# Altium project Retro_Stat_ESE516.PrjPcb
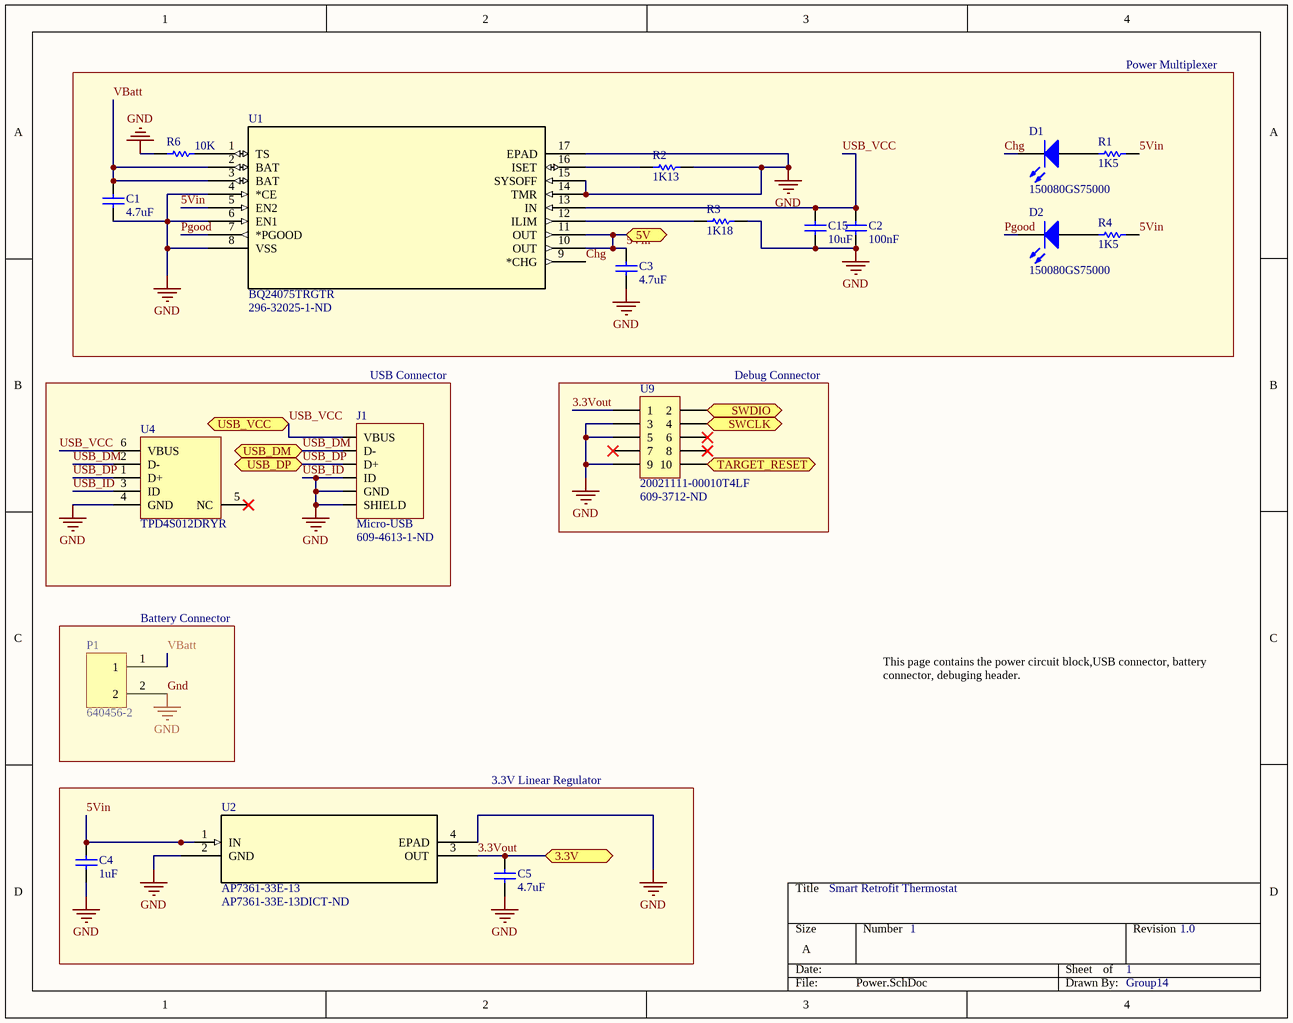
[diagram p0: Power.SchDoc]
3 sheets, 70 parts. Net scope: flat (ports and power ports of the same name join across sheets).
Board file: Retro_Stat_PCB_Layout.PcbDoc
Sheets:
  Power.SchDoc
  WIFI_module.SchDoc
  Sensors_Actuator_lib.SchDoc

## Sheet Power.SchDoc
size A

### Parts
C1  4.7uF  [CAPC0805(2012)155_L]
C2  100nF  [CAPC0805(2012)100_L]
C3  4.7uF  [CAPC0805(2012)155_L]
C4  1uF  [CAPC0805(2012)100_L]
C5  4.7uF  [CAPC0805(2012)155_L]
C15  10uF  [CAPC0805(2012)100_L]
D1  150080GS75000  [0805_A]
D2  150080GS75000  [0805_A]
J1  Micro-USB  Supplier Part Number 1: 609-4613-1-ND  [10118192-0001LF]
P1  640456-2  [640456-2]
R1  1K5  [RESC0805(2012)_M]
R2  1K13  [RESC0805(2012)_L]
R3  1K18  [RESC0805(2012)_M]
R4  1K5  [RESC0805(2012)_M]
R6  10K  [RESC0805(2012)_M]
U1  BQ24075TRGTR  Supplier Part Number 1: 296-32025-1-ND  [RGT16_1P7X1P7]
U2  AP7361-33E-13  Supplier Part Number 1: AP7361-33E-13DICT-ND  [SOT-223]
U4  TPD4S012DRYR  [DRY0006A]
U9  20021111-00010T4LF  Supplier Part Number 1: 609-3712-ND  [20021111-00010T4LF]

### Blocks framed on the sheet
Power Multiplexer: C1-C3 C15 D1 D2 R1-R4 R6 U1
USB Connector: J1 U4
Debug Connector: U9
Battery Connector: P1
3.3V Linear Regulator: C4 C5 U2

### Ports
3.3V, 5V, SWCLK (bidir), SWDIO (bidir), TARGET_RESET (out), USB_DM (bidir), USB_DP (bidir), USB_VCC

### Nets
Gnd: C1.1 C2.1 C3.1 C4.1 C5.1 C15.1 J1.4(ID) J1.5(GND) J1.6(SHIELD) P1.2 R2.2 R3.2 R6.1 U1.4(*CE) U1.6(EN1) U1.8(VSS) U1.14(TMR) U1.15(SYSOFF) U1.17(EPAD) U2.2(GND) U2.4(EPAD) U4.3(ID) U4.4(GND) U9.3 U9.5 U9.9  [also labelled USB_ID]
3.3Vout: C5.2 U2.3(OUT) U9.1 ; port 3.3V
5Vin: C3.2 C4.2 R1.2 R4.2 U1.5(EN2) U1.10(OUT) U1.11(OUT) U2.1(IN) ; port 5V
Chg: D1.1(K) U1.9(*CHG)
Pgood: D2.1(K) U1.7(*PGOOD)
TARGET_RESET: U9.10 ; port TARGET_RESET
USB_DM: J1.2(D-) U4.2(D-) ; port USB_DM
USB_DP: J1.3(D+) U4.1(D+) ; port USB_DP
USB_VCC: C2.2 C15.2 J1.1(VBUS) U1.13(IN) U4.6(VBUS) ; port USB_VCC
VBatt: C1.2 P1.1 U1.2(BAT) U1.3(BAT)
NetD1_2: D1.2(A) R1.1
NetD2_2: D2.2(A) R4.1
NetR2_1: R2.1 U1.16(ISET)
NetR3_1: R3.1 U1.12(ILIM)
NetR6_2: R6.2 U1.1(TS)
NetU3_25: U9.4 ; port SWCLK
NetU3_26: U9.2 ; port SWDIO

Not connected (* = marked no-connect by the designer): U4 5(NC)*; U9 6* 7* 8*

### Notes on the sheet
- This page contains the power circuit block,USB connector, battery connector, debuging header.
- Smart Retrofit Thermostat
- 1
- 1.0
- Group14

### Library data of the parts
C1 C3 C5 = CMP-1036-04882-1: CAP 4.7uF 10V ±10% 0805 (2012 Metric) Thickness 1.55mm SMD; Case-EIA: 0805; Tolerance: Â±10%; Case-Metric: 2012; Value: 4.7uF; Rated Voltage: 10 V; Max Thickness: 1.55 mm; Technology: SMT
C2 = CMP-1036-04407-1: CAP 100nF 16V -20% to +80% 0805 (2012 Metric) Thickness 1mm SMD; Case-EIA: 0805; Case-Metric: 2012; Value: 100nF; Rated Voltage: 16 V; Max Thickness: 1 mm; Technology: SMT; Tolerance: -20% to +80%
C4 = CMP-1036-04734-1: CAP 1uF 6.3V ±20% 0805 (2012 Metric) Thickness 1mm SMD; Case-EIA: 0805; Tolerance: Â±20%; Case-Metric: 2012; Value: 1uF; Rated Voltage: 6.3 V; Max Thickness: 1 mm; Technology: SMT
C15 = CMP-1036-04930-1: CAP 10uF 16V ±20% 0805 (2012 Metric) Thickness 1mm SMD; Case-EIA: 0805; Tolerance: Â±20%; Case-Metric: 2012; Value: 10uF; Rated Voltage: 16 V; Max Thickness: 1 mm; Technology: SMT
D1 D2 = CMP-1426-00007-1: SMD mono-color Chip LED, WL-SMCW, Green; Manufacturer: Wuerth Elektronik; PackageReference: 0805_A; Color: Green; PartNumber: 150080GS75000; ComponentLink2URL: http://katalog.we-online.com/led/datasheet/150080GS75000.pdf; ComponentLink1URL: http://www.we-online.com; ComponentLink1Description: Manufacturer URL; ComponentLink2Description: Datasheet
J1 = 10118192-0001LF: CONN USB MICRO B RECPT SMT R/A; HelpURL: http://portal.fciconnect.com/Comergent//fci/drawing/10118192.pdf; Supplier 1: Digi-Key
P1 = 640456-2: CONN HEADER VERT 2POS .100 TIN; Manufacturer: TE Connectivity; Underplate Material: Nickel; Connector Type: Plug,Pin,Header; Contact Resistance: 6mR; Max Current Rating: 5A; Max Voltage Rating (AC): 250V; Number of Positions: 2; Backwall/Post Interruptions: No (Without); Connector System: Wire-to-Board; Plating Thickness: 3.81um; PCB Mount Retention: Without; Gender: Male; Contact Style: Straight; PCB Mounting Orientation: Vertical; Pitch: 2.54mm; Mating Post Length: 7.49mm; PCB Thickness: 0.063inch; Tail Length: 3.56mm; Approvals: CSA; Supplier 1: Digi-Key; Manufacturer Part Number: 640456-2; Stock 1: 141304; Pricing 1: 1=0.12, 10=0.117, 100=0.0724, 500=0.0599, 1000=0.0524, 5000=0.0449, 10000=0.0437 (USD); Mount: Through Hole; Colour: White,Natural,Beige; Contact Plating: Tin; Contact Material: Copper Alloy; Housing Colour: Natural; Housing Material: Polyester; Contact Shape: Square; Min Operating Temperature: -67°C; Max Operating Temperature: 221°C; Package Quantity: 5000; Packaging: Bulk; Termination: Solder; Number of Rows: 1; Fastening Type: Friction; Contact Gender: Male; Voltage Rating (AC): 250V; Number of Contacts: 2; Orientation: Straight; Contact Retention: No (Without); Mating Alignment: No (Without); Mating Retention: No (Without); PCB Mount Alignment: No (Without); Panel Mount Retention: No (Without); Sealable: No (Without); Strain Relief: No (Without); Current Rating: 5A; Number of Poles: 2; Voltage Rating: 250V; Working Voltage: 250V; Length: 5.08mm; Height: 7.87mm; Depth: 5.72mm; Lead Pitch: 2.54mm; Contact Mating Length: 0.295inch; Termination Post Length: 3.56mm; Radiation Hardening: No; ELV: Compliant; Lead Free: Lead Free; Flammability Rating: UL94 V-0; REACH SVHC: No SVHC; ComponentLink1URL: https://datasheet.ciiva.com/709/eng-cd-640456-w1-709680.pdf; ComponentLink1Description: https://datasheet.ciiva.com/709/eng-cd-640456-w1-709680.pdf; ComponentLink2URL: https://datasheet.ciiva.com/3118/eng-ds-82056-mta-0608-3118497.pdf; ComponentLink2Description: https://datasheet.ciiva.com/3118/eng-ds-82056-mta-0608-3118497.pdf; ComponentLink3URL: https://datasheet.ciiva.com/19462/613931-19462481.pdf; ComponentLink3Description: https://datasheet.ciiva.com/19462/613931-19462481.pdf; ComponentLink4URL: https://datasheet.ciiva.com/14156/04384301-14156820.pdf; ComponentLink4Description: https://datasheet.ciiva.com/14156/04384301-14156820.pdf; ComponentLink5URL: https://datasheet.ciiva.com/7128/1866390-7128742.pdf; ComponentLink5Description: https://datasheet.ciiva.com/7128/1866390-7128742.pdf; ComponentLink6URL: https://datasheet.ciiva.com/16401/eng-ds-82056-mta-0608-16401289.pdf; ComponentLink6Description: https://datasheet.ciiva.com/16401/eng-ds-82056-mta-0608-16401289.pdf; ComponentLink7URL: https://datasheet.ciiva.com/16505/eng-ds-82056-mta-0608-16505419.pdf; ComponentLink7Description: https://datasheet.ciiva.com/16505/eng-ds-82056-mta-0608-16505419.pdf; ComponentLink8URL: https://datasheet.ciiva.com/25617/0900766b80027008-25617244.pdf; ComponentLink8Description: https://datasheet.ciiva.com/25617/0900766b80027008-25617244.pdf; ComponentLink9URL: https://datasheet.ciiva.com/11746/0900766b80eb7fdd-11746365.pdf; ComponentLink9Description: https://datasheet.ciiva.com/11746/0900766b80eb7fdd-11746365.pdf; Supplier Part Number 1: A1921-ND
R1 R4 = CMP-1013-00528-1: 1K5 0.125W 1% 0805 (2012 Metric)  SMD; Value: 1500.00 Ohm; Case-Metric: 2012; Case-EIA: 0805; Technology: SMT; Power: 0.125 W; Tolerance: 1 %
R2 = CMP-1013-00515-1: 1K13 0.125W 1% 0805 (2012 Metric)  SMD; Value: 1130.00 Ohm; Case-Metric: 2012; Case-EIA: 0805; Tolerance: 1 %; Technology: SMT; Power: 0.125 W
R3 = CMP-1013-00517-1: 1K18 0.125W 1% 0805 (2012 Metric)  SMD; Value: 1180.00 Ohm; Case-EIA: 0805; Case-Metric: 2012; Tolerance: 1 %; Technology: SMT; Power: 0.125 W
R6 = CMP-1013-00623-1: 10K 0.125W 1% 0805 (2012 Metric)  SMD; Value: 10000.00 Ohm; Case-Metric: 2012; Case-EIA: 0805; Technology: SMT; Power: 0.125 W; Tolerance: 1 %
U1 = BQ24075TRGTR: Imported; Manufacturer: Texas Instruments; Built_By: EMA_UL_Team; C: Copyright (C) 2015 Accelerated Designs. All rights reserved; Vendor: Vendor; Manufacturer_Part_Number: BQ24075TRGTR; Value: Value; Type: Type; RefDes: RefDes; Supplier 1: Digi-Key
U2 = AP7361-33E-13: Imported; Vendor: Diodes Inc; Built_By: EMA_UL_Team; Manufacturer_Part_Number: AP7361-33E-13; Value: Value; Type: Type; RefDes: RefDes; Supplier 1: Digi-Key
U4 = CMP-0326-00038-3: USB ESD Solution with Power Clamp, 4 Channels, -40 to +85 degC, 6-pin SON (DRY), Green (RoHS & no Sb/Br); Manufacturer: Texas Instruments; IO Capacitance(Typ)(pF): 0.8; USB High Speed: TRUE; IEC 61000-4-2 Air-Gap(+/- kV): 10; Breakdown Voltage(Min)(V): 6; PackageDescription: 6-Pin Plastic Small Outline No-Lead, 1 x 1.45 x 0.6 mm Body, 0.5 mm Pitch; ComponentLink2URL: http://www.ti.com/general/docs/lit/getliterature.tsp?genericPartNumber=TPD4S012&fileType=pdf; PackageVersion: revF, Dec-2011; ComponentLink3URL: SamplesURL:http://www.ti.com/product/tpd4s012#samples; ComponentLink2Description: Datasheet; IEC 61000-4-2 Contact(+/- kV): 10; DatasheetVersion: SLVS928A; PackageReference: DRY0006A; ComponentLink3Description: URL Link1; Mounting Technology: Surface Mount; PartNumber: TPD4S012DRYR; ComponentLink1Description: Manufacturer URL; SubFamily: ESD Solution; IO Leakage Current(nA): 10; ComponentLink1URL: http://www.ti.com/; Eco-Plan: Green (RoHS & no Sb/Br)
U9 = 20021111-00010T4LF: CONN HEADER 10POS UNSHD VERT T/H; Manufacturer: Amphenol / FCI; Stack Height: 2.5 mm; Number of Positions / Contacts: 10; Brand: FCI; Pitch: 1.27 mm; Mounting Angle: Vertical; Current Rating: 10 A; Mating Post Length: 3.05 mm; Voltage Rating: 125 V; Manufacturer Part Number: 20021111-00010T4LF; Mounting Style: Through Hole; Product Category: Headers & Wire Housings; RoHS: Details; Series: Minitek; Product Type: Headers; Type: Unshrouded; Number of Positions: 10; Number of Rows: 2; Contact Plating: Gold; Housing Material: Plastic; Termination Style: Through Hole; Contact Material: Nickel; Packaging: Tube; Factory Pack Quantity: 93; Termination Post Length: 2.3 mm; ComponentLink1URL: https://datasheet.ciiva.com/1433/1079612-1433267.pdf; ComponentLink1Description: https://datasheet.ciiva.com/1433/1079612-1433267.pdf; ComponentLink2URL: https://datasheet.ciiva.com/409/20021111-409158.pdf; ComponentLink2Description: https://datasheet.ciiva.com/409/20021111-409158.pdf; ComponentLink3URL: https://datasheet.ciiva.com/5131/20021111-5131386.pdf; ComponentLink3Description: https://datasheet.ciiva.com/5131/20021111-5131386.pdf; ComponentLink4URL: https://datasheet.ciiva.com/9465/20021111-9465402.pdf; ComponentLink4Description: https://datasheet.ciiva.com/9465/20021111-9465402.pdf; Supplier 1: Digi-Key

## Sheet WIFI_module.SchDoc
size A
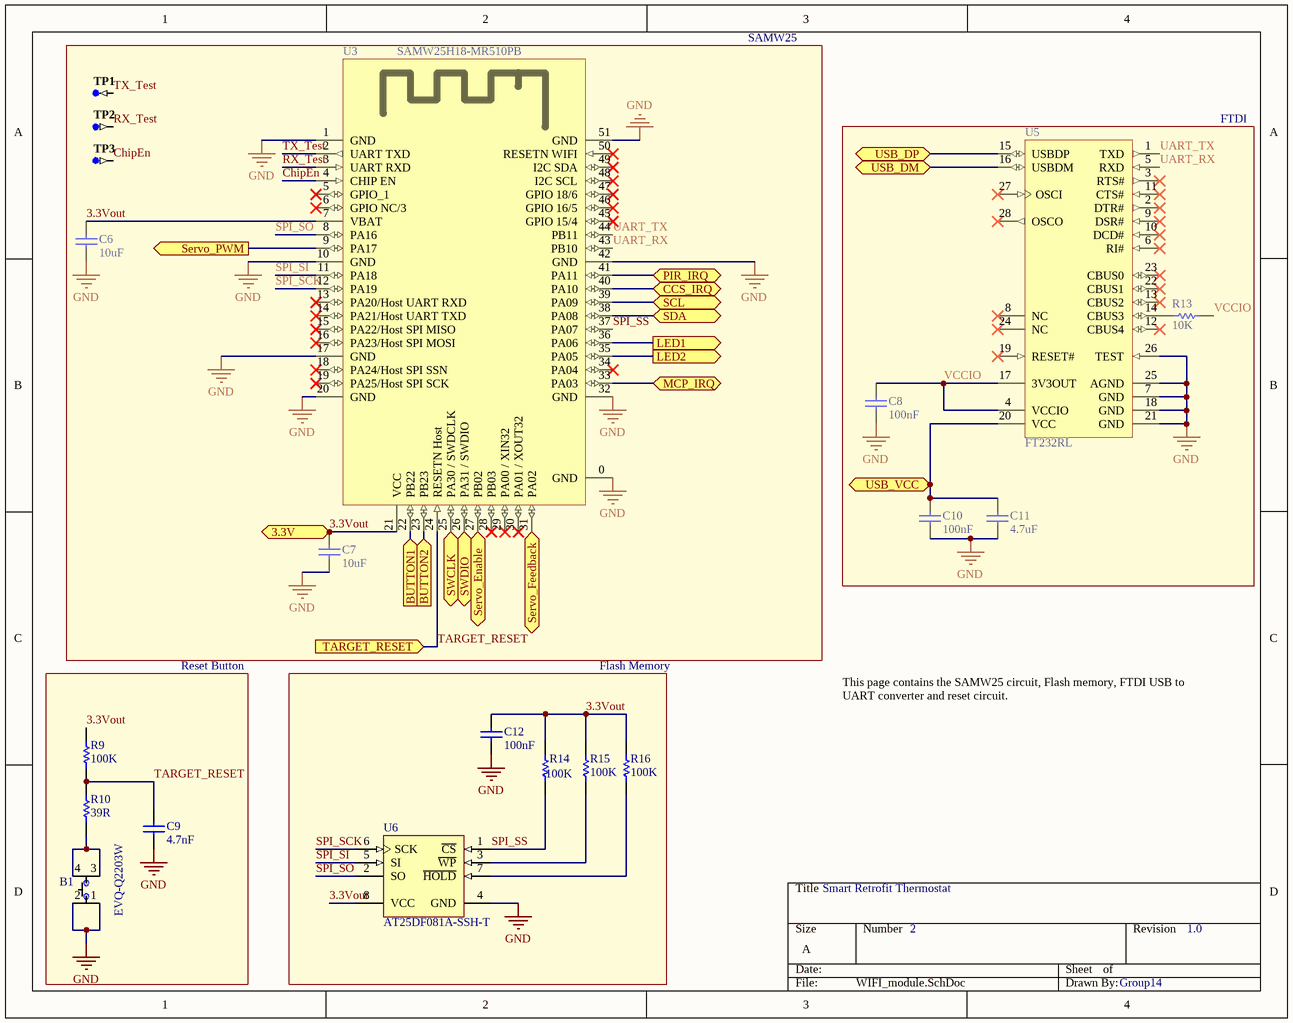
[diagram p1: WIFI_module.SchDoc]

### Parts
B1  EVQ-Q2203W  [EVQ-Q2203W]
C6  10uF  [CAPC0805(2012)100_L]
C7  10uF  [CAPC0805(2012)100_L]
C8  100nF  [CAPC0805(2012)145_M]
C9  4.7nF  [CAPC0805(2012)100_L]
C10  100nF  [CAPC0805(2012)145_M]
C11  4.7uF  [CAPC0805(2012)155_L]
C12  100nF  [CAPC0805(2012)145_M]
R9  100K  [RESC0805(2012)_L]
R10  39R  [RESC0805(2012)_N]
R13  10K  [RESC0805(2012)_M]
R14  100K  [RESC0805(2012)_L]
R15  100K  [RESC0805(2012)_L]
R16  100K  [RESC0805(2012)_L]
TP1  (no value)  [TP-SM-C-100]  (no BOM)
TP2  (no value)  [TP-SM-C-100]  (no BOM)
TP3  (no value)  [TP-SM-C-100]  (no BOM)
U3  SAMW25H18-MR510PB  [SAMW25H18-MR510PB]
U5  FT232RL  [FTDI-SSOP-28_M]
U6  AT25DF081A-SSH-T  [AT25DF081A-SSH-T]

### Blocks framed on the sheet
SAMW25: C6 C7 TP1-TP3 U3
FTDI: C8 C10 C11 R13 U5
Reset Button: B1 C9 R9 R10
Flash Memory: C12 R14-R16 U6

### Ports
3.3V, BUTTON1 (in), BUTTON2 (in), CCS_IRQ, LED1 (out), LED2 (out), MCP_IRQ, PIR_IRQ, SCL (bidir), SDA (bidir), Servo_Enable (out), Servo_Feedback (in), Servo_PWM (out), SWCLK (bidir), SWDIO (bidir), TARGET_RESET (in), USB_DM, USB_DP, USB_VCC

### Nets
Gnd: B1.1 B1.2 C6.1 C7.1 C8.1 C9.1 C10.1 C11.1 C12.1 U3.0(GND) U3.1(GND) U3.10(GND) U3.17(GND) U3.20(GND) U3.32(GND) U3.42(GND) U3.51(GND) U5.7(GND) U5.18(GND) U5.21(GND) U5.25(AGND) U5.26(TEST) U6.4(GND)
3.3Vout: C6.2 C7.2 C12.2 R9.1 R14.1 R15.1 R16.1 U3.7(VBAT) U3.21(VCC) U6.8(VCC) ; port 3.3V
CCS_IRQ: U3.40(PA10) ; port CCS_IRQ
ChipEn: TP3.1 U3.4(CHIP_EN)
MCP_IRQ: U3.33(PA03) ; port MCP_IRQ
RX_Test: TP2.1 U3.3(UART_RXD)
SCL: U3.39(PA09) ; port SCL
SDA: U3.38(PA08) ; port SDA
SPI_SCK: U3.12(PA19) U6.6(SCK)
SPI_SI: U3.11(PA18) U6.5(SI)
SPI_SO: U3.8(PA16) U6.2(SO)
SPI_SS: R14.2 U3.37(PA07) U6.1(~{CS})
TARGET_RESET: C9.2 R9.2 R10.1 U3.24(RESETN_Host) ; port TARGET_RESET
TX_Test: TP1.1 U3.2(UART_TXD)
UART_RX: U3.43(PB10) U5.5(RXD)
UART_TX: U3.44(PB11) U5.1(TXD)
USB_DM: U5.16(USBDM) ; port USB_DM
USB_DP: U5.15(USBDP) ; port USB_DP
USB_VCC: C10.2 C11.2 U5.20(VCC) ; port USB_VCC
VCCIO: C8.2 R13.2 U5.4(VCCIO) U5.17(3V3OUT)
NetB1_3: B1.3 B1.4 R10.2
NetC13_2: U3.22(PB22) ; port BUTTON1
NetC14_2: U3.23(PB23) ; port BUTTON2
NetP2_2: U3.41(PA11) ; port PIR_IRQ
NetP3_1: U3.9(PA17) ; port Servo_PWM
NetR7_2: U3.36(PA06) ; port LED1
NetR11_2: U3.35(PA05) ; port LED2
NetR12_1: U3.31(PA02) ; port Servo_Feedback
NetR13_1: R13.1 U5.14(CBUS3)
NetR15_2: R15.2 U6.3(~{WP})
NetR16_2: R16.2 U6.7(~{HOLD})
NetR20_2: U3.27(PB02) ; port Servo_Enable
NetU3_25: U3.25(PA30_/_SWDCLK) ; port SWCLK
NetU3_26: U3.26(PA31_/_SWDIO) ; port SWDIO

Not connected (* = marked no-connect by the designer): U3 5(GPIO_1)* 6(GPIO_NC/3)* 13(PA20/Host_UART_RXD)* 14(PA21/Host_UART_TXD)* 15(PA22/Host_SPI_MISO)* 16(PA23/Host_SPI_MOSI)* 18(PA24/Host_SPI_SSN)* 19(PA25/Host_SPI_SCK)* 28(PB03)* 29(PA00_/_XIN32)* 30(PA01_/_XOUT32)* 34(PA04)* 45(GPIO_15/4)* 46(GPIO_16/5)* 47(GPIO_18/6)* 48(I2C_SCL)* 49(I2C_SDA)* 50(RESETN_WIFI)*; U5 2(DTR#)* 3(RTS#)* 6(RI#)* 8(NC)* 9(DSR#)* 10(DCD#)* 11(CTS#)* 12(CBUS4)* 13(CBUS2)* 19(RESET#)* 22(CBUS1)* 23(CBUS0)* 24(NC)* 27(OSCI)* 28(OSCO)*

### Notes on the sheet
- This page contains the SAMW25 circuit, Flash memory, FTDI USB to UART converter and reset circuit.
- Smart Retrofit Thermostat
- 2
- 1.0
- Group14

### Library data of the parts
B1 = EVQ-Q2203W: SWITCH TACTILE SPST-NO 0.02A 15V; Manufacturer: Panasonic Electronic Components; Switch Function: Off-Mom; Contact Rating @ Voltage: 0.02A @ 15VDC; Actuator Type: Standard; Actuator Height off PCB, Vertical: 3.10mm; Actuator Orientation: Top Actuated; Outline: 6.60mm x 6.00mm; Illumination: Non-Illuminated; Operating Force: 350gf; Switch Travel: 0.25mm; Mechanical Life: 100,000 Cycles; Supplier 1: Digi-Key; Manufacturer Part Number: EVQ-Q2203W; RoHS: RoHS Compliant; Category: Switches; Stock 1: 15024; Pricing 1: 1=0.3, 10=0.287, 25=0.2772, 50=0.2674, 100=0.2525, 250=0.2376, 500=0.2277, 1000=0.17325 (USD); Packaging: Cut Tape (CT); Part Status: Active; Circuit: SPST-NO; Mounting Type: Surface Mount; Actuator Length, Right Angle: -; Termination Style: J Lead; Illumination Type, Color: -; Illumination Voltage (Nominal): -; Ingress Protection: -; Features: Grounding Pin; Actuator Material: -; Operating Temperature: -40°C ~ 85°C; ComponentLink1URL: https://industrial.panasonic.com/cdbs/www-data/pdf/ATK0000/ATK0000CE28.pdf; ComponentLink1Description: https://industrial.panasonic.com/cdbs/www-data/pdf/ATK0000/ATK0000CE28.pdf; Supplier Part Number 1: P12964SCT-ND
C6 C7 = CMP-1036-04930-1: as C15 on sheet Power; Value: 10uF; Rated Voltage: 16 V; Max Thickness: 1 mm; Technology: SMT
C8 C10 C12 = CMP-1036-04404-1: CAP 100nF 16V ±20% 0805 (2012 Metric) Thickness 1.45mm SMD; Case-EIA: 0805; Tolerance: Â±20%; Case-Metric: 2012; Value: 100nF; Rated Voltage: 16 V; Max Thickness: 1.45 mm; Technology: SMT
C9 = CMP-1036-03568-1: CAP 4.7nF 16V ±20% 0805 (2012 Metric) Thickness 1mm SMD; Case-EIA: 0805; Tolerance: Â±20%; Case-Metric: 2012; Value: 4.7nF; Rated Voltage: 16 V; Max Thickness: 1 mm; Technology: SMT
C11 = CMP-1036-04882-1: as C1 on sheet Power; Value: 4.7uF; Rated Voltage: 10 V; Max Thickness: 1.55 mm; Technology: SMT
R9 R14-R16 = CMP-1013-00736-1: 100K 0.125W 1% 0805 (2012 Metric)  SMD; Value: 100000.00 Ohm; Case-Metric: 2012; Case-EIA: 0805; Technology: SMT; Power: 0.125 W; Tolerance: 1 %
R10 = CMP-1013-00350-1: 39R 0.125W 1% 0805 (2012 Metric)  SMD; Value: 39.00 Ohm; Case-Metric: 2012; Case-EIA: 0805; Technology: SMT; Power: 0.125 W; Tolerance: 1 %
R13 = CMP-1013-00623-1: as R6 on sheet Power; Technology: SMT; Power: 0.125 W; Tolerance: 1 %
TP1-TP3 = CMP-0484-00002-2: Test Point, Surface Mount, Circular, Pad Diameter 1 mm; Manufacturer: No Vendor; PartNumber: TP-SM-C-100
U3 = SAMW25H18-MR510PB: RF TXRX MODULE WIFI TRACE ANT; Manufacturer: Atmel; Manufacturer Part Number: ATSAMW25H18-MR510PB; Protocol: 802.11b/g/n; Frequency: 2.4GHz; Data Rate: 65Mbps; Power - Output: 17dBm; Sensitivity: -95.5dBm; Serial Interfaces: SPI, UART; Antenna Type: Integrated, Trace; Memory Size: 256kB Flash, 32kB SRAM; Voltage - Supply: 2.7 V ~ 4.2 V; Category: RF/IF and RFID; Family: RF Transceiver Modules; Series: Xplained Pro; Packaging: Tray; RF Family/Standard: WiFi; Modulation: -; Current - Receiving: -; Current - Transmitting: -; Mounting Type: Surface Mount; Operating Temperature: -40°C ~ 85°C; Package / Case: Module; ComponentLink1URL: http://www.atmel.com/devices/ATSAMW25.aspx; ComponentLink1Description: http://www.atmel.com/devices/ATSAMW25.aspx; ComponentLink2URL: http://www.farnell.com/datasheets/1965115.pdf; ComponentLink2Description: http://www.farnell.com/datasheets/1965115.pdf; Supplier 1: Digikey; Stock 1: 120; Pricing 1: 1=19.14 (USD); Supplier Part Number 1: ATSAMW25H18-MR510PB-ND
U5 = CMP-2000-05029-1: IC USB FS SERIAL UART 28-SSOP; Manufacturer: FTDI; Receive FIFO: 256B; Number of Channels per Chip: 1; Maximum Data Rate: 3MBd; Transmit FIFO: 128B; Dimensions: 10.2x5.3x1.75mm; Mounting Type: SurfaceMount; Height: 1.75mm; Package Type: SSOP; Datasheet Version: Rev. 1.04, 02/2006; Width: 5.3mm; Manufacturer URL: http://www.ftdichip.com/; Datasheet URL: http://datasheet.octopart.com/FT232RL-FTDI-datasheet-120501.pdf; Maximum Operating Temperature: +85degC; Minimum Operating Temperature: -40degC; Pin Count: 28; Length: 10.2mm
U6 = AT25DF081A-SSH-T: IC FLASH 8MBIT 100MHZ 8SOIC; Manufacturer: Adesto Technologies; Memory Size: 8M (4096 pages x 256 bytes); Interface: SPI, RapidS; Voltage - Supply: 2.7 V ~ 3.6 V; Rad Hard: No; Manufacturer Part Number: AT25DF081A-SSH-T; RoHS: RoHS Compliant; Category: Integrated Circuits (ICs); Packaging: Cut Tape (CT); Part Status: Active; Format - Memory: FLASH; Memory Type: FLASH; Speed: 100MHz; Operating Temperature: -40°C ~ 85°C (TC); Package / Case: 8-SOIC (0.154", 3.90mm Width); Supplier Device Package: 8-SOIC; ComponentLink1URL: http://www.adestotech.com/wp-content/uploads/doc8715.pdf; ComponentLink1Description: http://www.adestotech.com/wp-content/uploads/doc8715.pdf; Supplier 1: Digikey; Stock 1: 2550; Pricing 1: 1=1.18, 10=1.081, 25=1.0516, 50=1.0462, 100=0.9352, 250=0.9324, 500=0.9185, 1000=0.8791 (USD); Package: 8SOIC; ComponentLink2URL: https://datasheet.ciiva.com/14084/doc8715-14084443.pdf; ComponentLink2Description: https://datasheet.ciiva.com/14084/doc8715-14084443.pdf; ComponentLink3URL: https://datasheet.ciiva.com/26910/getdatasheetpartid-730210-26910875.pdf; ComponentLink3Description: https://datasheet.ciiva.com/26910/getdatasheetpartid-730210-26910875.pdf; ComponentLink4URL: https://datasheet.ciiva.com/12251/doc8715-12251468.pdf; ComponentLink4Description: https://datasheet.ciiva.com/12251/doc8715-12251468.pdf; Supplier Part Number 1: 1265-1166-1-ND

## Sheet Sensors_Actuator_lib.SchDoc
size A
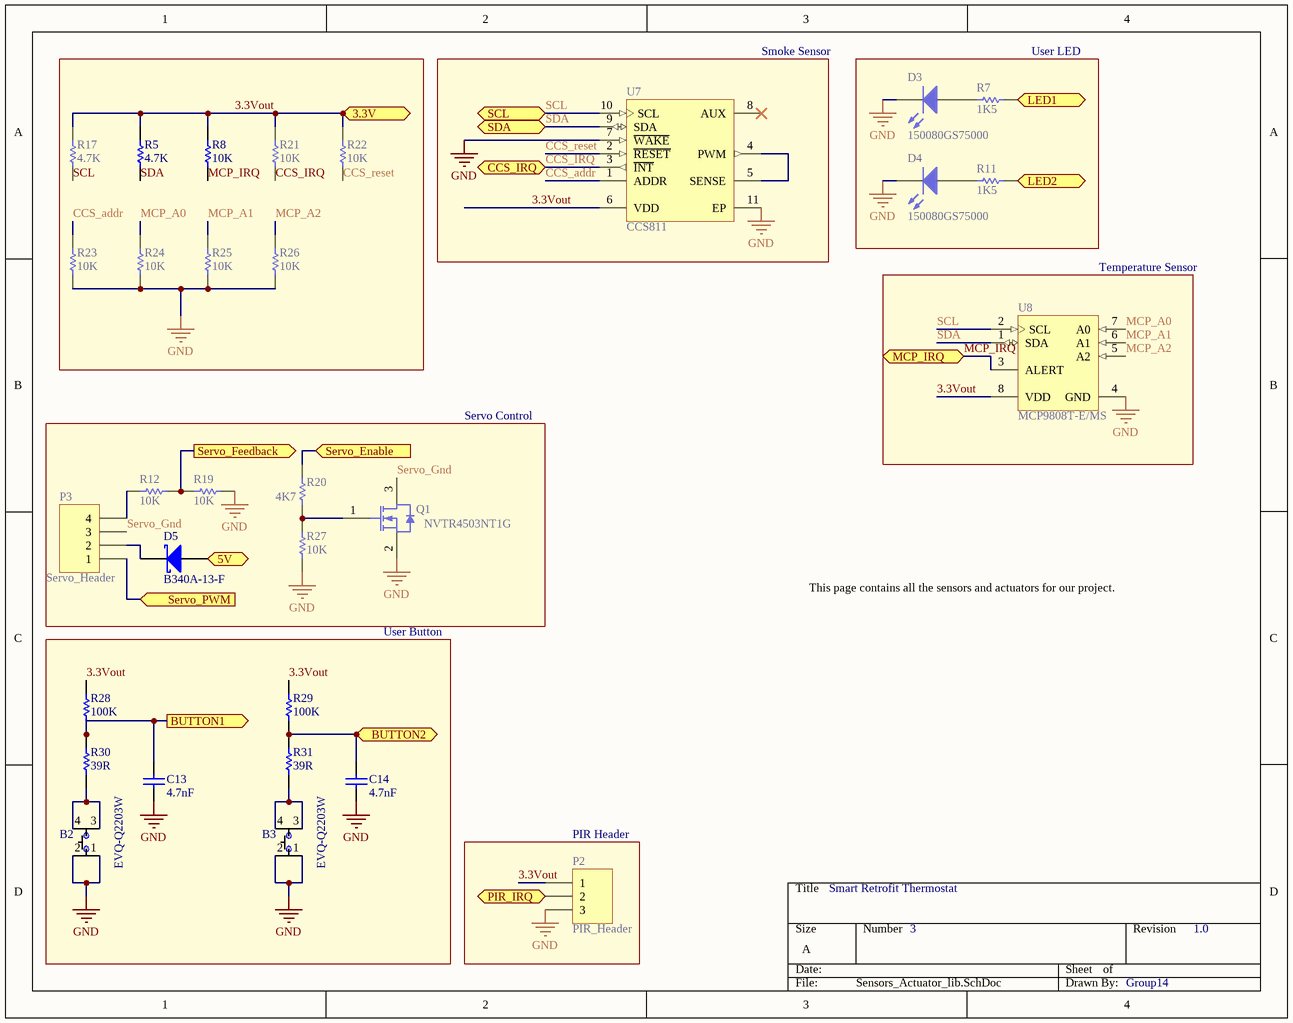
[diagram p2: Sensors_Actuator_lib.SchDoc]

### Parts
B2  EVQ-Q2203W  [EVQ-Q2203W]
B3  EVQ-Q2203W  [EVQ-Q2203W]
C13  4.7nF  [CAPC0805(2012)100_L]
C14  4.7nF  [CAPC0805(2012)100_L]
D3  150080GS75000  [0805_A]
D4  150080GS75000  [0805_A]
D5  B340A-13-F  [DIOD-SMA-2_V]
P2  PIR_Header  [HDR1X3]
P3  Servo_Header  [HDR1X4]
Q1  NVTR4503NT1G  [ONSC-SOT-23-3-318-08_V]
R5  4.7K  [RESC2113X50X35ML15T15]
R7  1K5  [RESC0805(2012)_M]
R8  10K  [RESC0805(2012)_M]
R11  1K5  [RESC0805(2012)_M]
R12  10K  [RESC0805(2012)_M]
R17  4.7K  [RESC2113X50X35ML15T15]
R19  10K  [RESC0805(2012)_M]
R20  4K7  [RESC0805(2012)_M]
R21  10K  [RESC0805(2012)_M]
R22  10K  [RESC0805(2012)_M]
R23  10K  [RESC0805(2012)_M]
R24  10K  [RESC0805(2012)_M]
R25  10K  [RESC0805(2012)_M]
R26  10K  [RESC0805(2012)_M]
R27  10K  [RESC0805(2012)_M]
R28  100K  [RESC0805(2012)_L]
R29  100K  [RESC0805(2012)_L]
R30  39R  [RESC0805(2012)_N]
R31  39R  [RESC0805(2012)_N]
U7  CCS811  [AMS-LGA-10_V]
U8  MCP9808T-E/MS  [MCHP-MSOP-MS8_M]

### Blocks framed on the sheet
Smoke Sensor: U7
User LED: D3 D4 R7 R11
Temperature Sensor: U8
Servo Control: D5 P3 Q1 R12 R19 R20 R27
User Button: B2 B3 C13 C14 R28-R31
PIR Header: P2

### Ports
3.3V, 5V, BUTTON1 (out), BUTTON2 (out), CCS_IRQ, LED1 (in), LED2 (in), MCP_IRQ, PIR_IRQ, SCL (bidir), SDA (bidir), Servo_Enable (in), Servo_Feedback (out), Servo_PWM (in)

### Nets
Gnd: B2.1 B2.2 B3.1 B3.2 C13.1 C14.1 D3.1(K) D4.1(K) P2.3 Q1.2(S) R19.1 R23.1 R24.1 R25.1 R26.1 R27.1 U7.7(~{WAKE}) U7.11(EP) U8.4(GND)
3.3Vout: P2.1 R5.2 R8.2 R17.2 R21.2 R22.2 R28.1 R29.1 U7.6(VDD) U8.8(VDD) ; port 3.3V
5Vin: D5.1(A) ; port 5V
CCS_addr: R23.2 U7.1(ADDR)
CCS_IRQ: R21.1 U7.3(~{INT}) ; port CCS_IRQ
CCS_reset: R22.1 U7.2(~{RESET})
MCP_A0: R24.2 U8.7(A0)
MCP_A1: R25.2 U8.6(A1)
MCP_A2: R26.2 U8.5(A2)
MCP_IRQ: R8.1 U8.3(ALERT) ; port MCP_IRQ
SCL: R17.1 U7.10(SCL) U8.2(SCL) ; port SCL
SDA: R5.1 U7.9(SDA) U8.1(SDA) ; port SDA
Servo_Gnd: P3.3 Q1.3(D)
NetB2_3: B2.3 B2.4 R30.2
NetB3_3: B3.3 B3.4 R31.2
NetC13_2: C13.2 R28.2 R30.1 ; port BUTTON1
NetC14_2: C14.2 R29.2 R31.1 ; port BUTTON2
NetD3_2: D3.2(A) R7.1
NetD4_2: D4.2(A) R11.1
NetD5_2: D5.2(K) P3.2
NetP2_2: P2.2 ; port PIR_IRQ
NetP3_1: P3.1 ; port Servo_PWM
NetP3_4: P3.4 R12.2
NetQ1_1: Q1.1(G) R20.1 R27.2
NetR7_2: R7.2 ; port LED1
NetR11_2: R11.2 ; port LED2
NetR12_1: R12.1 R19.2 ; port Servo_Feedback
NetR20_2: R20.2 ; port Servo_Enable
NetU7_4: U7.4(PWM) U7.5(SENSE)

Not connected (* = marked no-connect by the designer): U7 8(AUX)*

### Notes on the sheet
- This page contains all the sensors and actuators for our project.
- Smart Retrofit Thermostat
- 3
- 1.0
- Group14

### Library data of the parts
B2 B3 = EVQ-Q2203W: as B1 on sheet WIFI_module; Supplier 1: Digi-Key; Manufacturer Part Number: EVQ-Q2203W; RoHS: RoHS Compliant; Category: Switches; Stock 1: 15024; Pricing 1: 1=0.3, 10=0.287, 25=0.2772, 50=0.2674, 100=0.2525, 250=0.2376, 500=0.2277, 1000=0.17325 (USD); Packaging: Cut Tape (CT); Part Status: Active; Circuit: SPST-NO; Mounting Type: Surface Mount; Actuator Length, Right Angle: -; Termination Style: J Lead; Illumination Type, Color: -; Illumination Voltage (Nominal): -; Ingress Protection: -; Features: Grounding Pin; Actuator Material: -; Operating Temperature: -40°C ~ 85°C; ComponentLink1URL: https://industrial.panasonic.com/cdbs/www-data/pdf/ATK0000/ATK0000CE28.pdf; ComponentLink1Description: https://industrial.panasonic.com/cdbs/www-data/pdf/ATK0000/ATK0000CE28.pdf; Supplier Part Number 1: P12964SCT-ND
C13 C14 = CMP-1036-03568-1: as C9 on sheet WIFI_module; Value: 4.7nF; Rated Voltage: 16 V; Max Thickness: 1 mm; Technology: SMT
D3 D4 = CMP-1426-00007-1: as D1 on sheet Power; PackageReference: 0805_A; Color: Green; PartNumber: 150080GS75000; ComponentLink2URL: http://katalog.we-online.com/led/datasheet/150080GS75000.pdf; ComponentLink1URL: http://www.we-online.com; ComponentLink1Description: Manufacturer URL; ComponentLink2Description: Datasheet
D5 = CMP-1667-00003-1: Surface Mount Schottky Barrier Rectifier, 40 V, 3 A, -55 to 150 degC, 2-Pin SMA, RoHS, Tape and Reel; Forward Current: 3 A; Forward Voltage: 500 mV; Max Surge Current: 80 A; Peak Reverse Current: 500 uA; Elements: 1; Mounting Technology: Surface Mount; ComponentLink1URL: http://www.diodes.com/; PackageDescription: 2-Pin Surface Mounted Assembly, Body 4.3 x 2.605 mm, Height 2.4 mm; Min Operating Temperature: -55 degC; Mount: Surface Mount; Pins: 2; ComponentLink2URL: http://www.diodes.com/_files/datasheets/ds30891.pdf; PackageReference: SMA-2; Max Operating Temperature: 125 degC; Radiation Hardening: No; Length: 4.6 mm; RoHSCompliant: true; ComponentLink1Description: Manufacturer URL; Height: 2.1 mm; ComponentLink2Description: Datasheet; Packaging: Tape and Reel; Package Quantity: 5000; Case\Package: SMA; DatasheetVersion: Rev. 17 - 2, 09/2015; REACH SVHC: No SVHC; Width: 2.92 mm
P2 = Header 3: Header, 3-Pin; LatestRevisionDate: 17-Jul-2002; LatestRevisionNote: Re-released for DXP Platform.; Publisher: Altium Limited
P3 = Header 4: Header, 4-Pin; LatestRevisionDate: 17-Jul-2002; LatestRevisionNote: Re-released for DXP Platform.; Publisher: Altium Limited
Q1 = CMP-1058-00743-1: Power MOSFET, 30 V, 2.5 A, Single N-Channel, 3-Pin SOT-23, Pb-Free, Tape and Reel; Manufacturer: On Semiconductor; VGS(th) Max (V): 3; VGS Max (V): 20; Channel Polarity: N Channel; ID Max (A): 2.5; Qrr Typ (nC): 4; V(BR)DSS Min (V): 30; PackageReference: SOT-23-3-318-08; RoHS: Pb-Free; ComponentLink3Description: Package Specification; PackageVersion: Rev. AP, 11/2009; PartNumber: NVTR4503NT1G; ComponentLink1URL: http://www.onsemi.com/; ComponentLink2URL: http://www.onsemi.cn/pub_link/Collateral/NTR4503N-D.PDF; ComponentLink1Description: Manufacturer URL; Packing: Tape and Reel; ComponentLink2Description: Datasheet; Package Type: SOT-23-3; Configuration: Single; Mounting Technology: Surface Mount; ComponentLink3URL: http://www.onsemi.cn/pub_link/Collateral/318-08.PDF; PackageDescription: 3-Pin Small Outline Transistor, Body 2.92 x 1.3 mm, Pitch 0.95 mm; DatasheetVersion: Rev. 6
R5 R17 = CMP-2100-03615-1: Chip Resistor, 4.7 KOhm, +/- 1%, 0.125 W, -55 to 155 degC, 0805 (2012 Metric), RoHS, Tape and Reel; Manufacturer: Vishay Semiconductor; Temperature Coefficient: 100ppm/degreesC; Voltage Rating: 150V; Max Power Dissipation: 125mW; Tolerance: 1%; Packaging: TapeandReel; Max Operating Temperature: 155degC; Case Code (Imperial): 0805; Case/Package: 0805; Radiation Hardening: No; Package Reference: 0805; Lead Free: LeadFree; Package Description: 2-Pin Surface Mount Device, Body 2.05 x 1.25 mm; Manufacturer URL: http://www.vishay.com/; Height: 0.45mm; REACH SVHC: Unknown; Termination: SMD/SMT; Length: 2mm; Depth: 1.25mm; Case Code (Metric): 2012; Package Quantity: 10; Weight: 0.000194oz; Military Standard: Not; RoHSCompliant: true; Composition: ThickFilm; Contact Plating: Tin; Datasheet Version: 41061.0; Datasheet URL: https://datasheet.ciiva.com/11808/0900766b80d98b26-11808992.pdf; Width: 1.25mm; Number of Terminations: 2; Min Operating Temperature: -55degC; Power Rating: 125mW; Resistance: 4.7KOhm; Voltage Rating (DC): 150V
R7 R11 = CMP-1013-00528-1: as R1 on sheet Power; Technology: SMT; Power: 0.125 W; Tolerance: 1 %
R8 R12 R19 R21-R27 = CMP-1013-00623-1: as R6 on sheet Power; Technology: SMT; Power: 0.125 W; Tolerance: 1 %
R20 = CMP-1013-00586-1: 4K7 0.125W 1% 0805 (2012 Metric)  SMD; Case-Metric: 2012; Case-EIA: 0805; Value: 4700.00 Ohm; Technology: SMT; Power: 0.125 W; Tolerance: 1 %
R28 R29 = CMP-1013-00736-1: as R9 on sheet WIFI_module; Technology: SMT; Power: 0.125 W; Tolerance: 1 %
R30 R31 = CMP-1013-00350-1: as R10 on sheet WIFI_module; Technology: SMT; Power: 0.125 W; Tolerance: 1 %
U7 = CMP-2000-07443-1: Ultra-Low Power Digital Gas Sensor for Monitoring Indoor Air Quality, 26 mA, 1.8 to 3.3 V, -5 to 50 degC, 10-Pin LGA, RoHS; Manufacturer: AMS; Package Description: 10-Pin Small Outline Non-lead, Body 4 x 2.7 mm, Pitch 0.6 mm; Datasheet URL: http://ams.com/eng/content/download/951091/2269479/471718; Manufacturer URL: http://www.ams.org/home/page; Datasheet Version: Rev. 1-02, 03/2017; Package Reference: LGA-10; RoHSCompliant: false; Mounting Technology: SurfaceMount
U8 = CMP-0192-00343-1: + / - 0.5 degC Maximum Accuracy Digital Temperature Sensor, 400 uA, 2.7 to 5.5 V, -40 to 125 degC, 8-pin MSOP (MS8), Tape and Reel; Manufacturer: Microchip; PackageVersion: C04-111C; ComponentLink1URL: http://www.microchip.com; ComponentLink2URL: http://ww1.microchip.com/downloads/en/DeviceDoc/25095A.pdf; PackageReference: MSOP-MS8; ComponentLink2Description: Datasheet; DatasheetVersion: Rev. A; ComponentLink1Description: Manufacturer URL; PackageDescription: 8-Lead Plastic Micro Small Outline Package, 3 x 3 mm Body, 0.65 mm Pitch; ComponentLink3Description: Package Specification; ComponentLink3URL: http://www.microchip.com/stellent/groups/techpub_sg/documents/packagingspec/en012702.pdf; PartNumber: MCP9808T-E/MS; ComponentLink4URL: http://www.microchip.com/MCP9808; ComponentLink4Description: Product URL; Mounting Technology: Surface Mount

## Nets that join several sheets
Gnd: Power (26 pins), WIFI_module (23 pins), Sensors_Actuator_lib (19 pins)
3.3Vout: Power (C5.2 U2.3 U9.1), WIFI_module (10 pins), Sensors_Actuator_lib (10 pins)
5Vin: Power (8 pins), Sensors_Actuator_lib (D5.1)
CCS_IRQ: WIFI_module (U3.40), Sensors_Actuator_lib (R21.1 U7.3)
MCP_IRQ: WIFI_module (U3.33), Sensors_Actuator_lib (R8.1 U8.3)
NetC13_2: WIFI_module (U3.22), Sensors_Actuator_lib (C13.2 R28.2 R30.1)
NetC14_2: WIFI_module (U3.23), Sensors_Actuator_lib (C14.2 R29.2 R31.1)
NetP2_2: WIFI_module (U3.41), Sensors_Actuator_lib (P2.2)
NetP3_1: WIFI_module (U3.9), Sensors_Actuator_lib (P3.1)
NetR7_2: WIFI_module (U3.36), Sensors_Actuator_lib (R7.2)
NetR11_2: WIFI_module (U3.35), Sensors_Actuator_lib (R11.2)
NetR12_1: WIFI_module (U3.31), Sensors_Actuator_lib (R12.1 R19.2)
NetR20_2: WIFI_module (U3.27), Sensors_Actuator_lib (R20.2)
NetU3_25: Power (U9.4), WIFI_module (U3.25)
NetU3_26: Power (U9.2), WIFI_module (U3.26)
SCL: WIFI_module (U3.39), Sensors_Actuator_lib (R17.1 U7.10 U8.2)
SDA: WIFI_module (U3.38), Sensors_Actuator_lib (R5.1 U7.9 U8.1)
TARGET_RESET: Power (U9.10), WIFI_module (C9.2 R9.2 R10.1 U3.24)
USB_DM: Power (J1.2 U4.2), WIFI_module (U5.16)
USB_DP: Power (J1.3 U4.1), WIFI_module (U5.15)
USB_VCC: Power (5 pins), WIFI_module (C10.2 C11.2 U5.20)